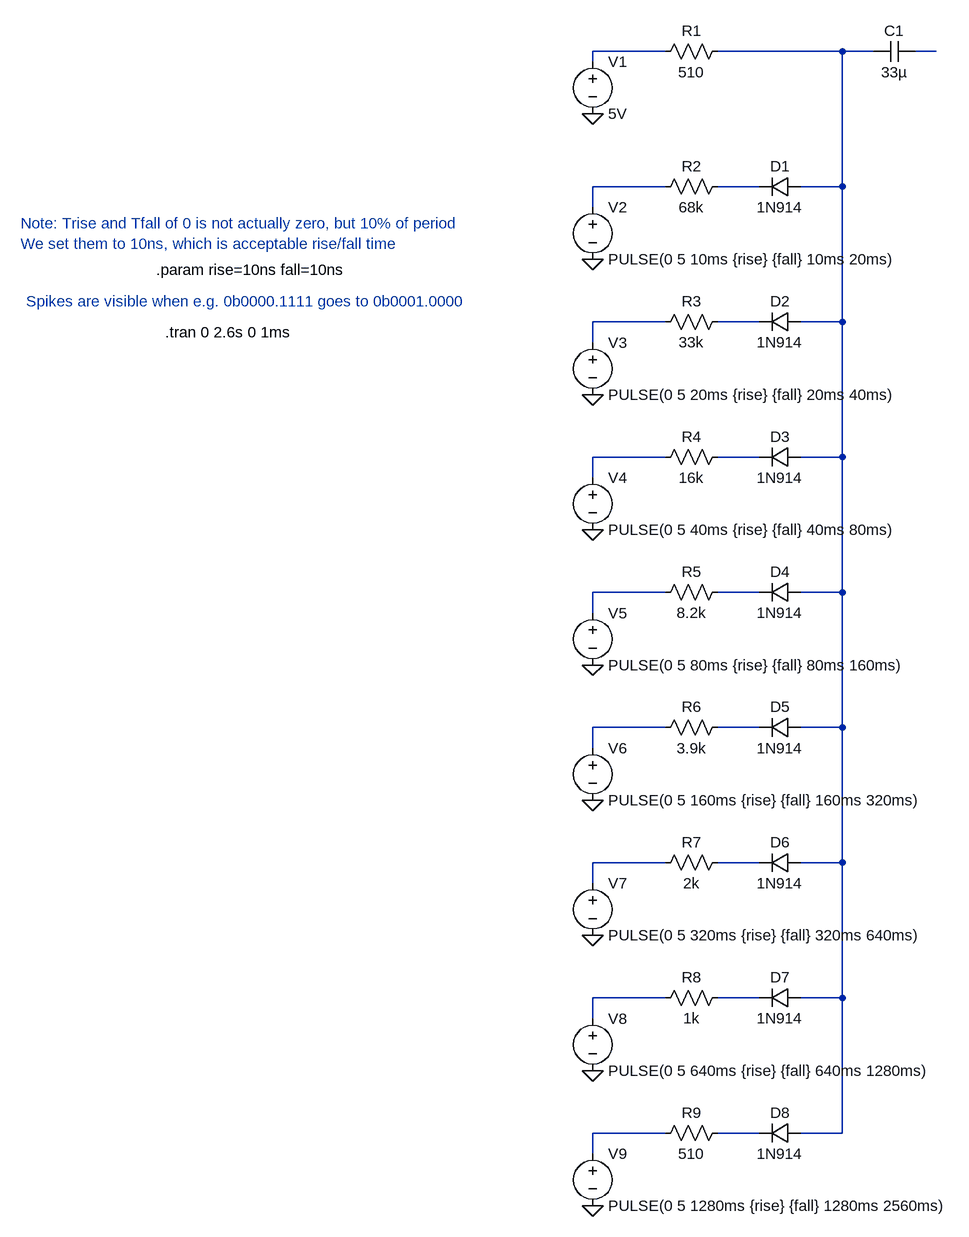
[diagram p0: schematic 542B-DAC.asc]
542B-DAC.asc, the LTspice schematic file:
Version 4
SHEET 1 880 1880
WIRE 144 64 32 64
WIRE 416 64 224 64
WIRE 464 64 416 64
WIRE 560 64 528 64
WIRE 32 80 32 64
WIRE 144 272 32 272
WIRE 288 272 224 272
WIRE 416 272 416 64
WIRE 416 272 352 272
WIRE 32 304 32 272
WIRE 144 480 32 480
WIRE 288 480 224 480
WIRE 416 480 416 272
WIRE 416 480 352 480
WIRE 32 512 32 480
WIRE 144 688 32 688
WIRE 288 688 224 688
WIRE 416 688 416 480
WIRE 416 688 352 688
WIRE 32 720 32 688
WIRE 144 896 32 896
WIRE 288 896 224 896
WIRE 416 896 416 688
WIRE 416 896 352 896
WIRE 32 928 32 896
WIRE 144 1104 32 1104
WIRE 288 1104 224 1104
WIRE 416 1104 416 896
WIRE 416 1104 352 1104
WIRE 32 1136 32 1104
WIRE 144 1312 32 1312
WIRE 288 1312 224 1312
WIRE 416 1312 416 1104
WIRE 416 1312 352 1312
WIRE 32 1344 32 1312
WIRE 144 1520 32 1520
WIRE 288 1520 224 1520
WIRE 416 1520 416 1312
WIRE 416 1520 352 1520
WIRE 32 1552 32 1520
WIRE 144 1728 32 1728
WIRE 288 1728 224 1728
WIRE 416 1728 416 1520
WIRE 416 1728 352 1728
WIRE 32 1760 32 1728
FLAG 32 160 0
FLAG 32 384 0
FLAG 32 592 0
FLAG 32 800 0
FLAG 32 1008 0
FLAG 32 1216 0
FLAG 32 1424 0
FLAG 32 1632 0
FLAG 32 1840 0
SYMBOL voltage 32 64 R0
WINDOW 123 0 0 Left 0
WINDOW 39 0 0 Left 0
SYMATTR InstName V1
SYMATTR Value 5V
SYMBOL res 240 48 R90
WINDOW 0 0 56 VBottom 2
WINDOW 3 32 56 VTop 2
SYMATTR InstName R1
SYMATTR Value 510
SYMBOL res 240 256 R90
WINDOW 0 0 56 VBottom 2
WINDOW 3 32 56 VTop 2
SYMATTR InstName R2
SYMATTR Value 68k
SYMBOL diode 352 256 R90
WINDOW 0 0 32 VBottom 2
WINDOW 3 32 32 VTop 2
SYMATTR InstName D1
SYMATTR Value 1N914
SYMBOL cap 528 48 R90
WINDOW 0 0 32 VBottom 2
WINDOW 3 32 32 VTop 2
SYMATTR InstName C1
SYMATTR Value 33µ
SYMBOL voltage 32 288 R0
WINDOW 123 0 0 Left 0
WINDOW 39 0 0 Left 0
SYMATTR InstName V2
SYMATTR Value PULSE(0 5 10ms {rise} {fall} 10ms 20ms)
SYMBOL res 240 464 R90
WINDOW 0 0 56 VBottom 2
WINDOW 3 32 56 VTop 2
SYMATTR InstName R3
SYMATTR Value 33k
SYMBOL diode 352 464 R90
WINDOW 0 0 32 VBottom 2
WINDOW 3 32 32 VTop 2
SYMATTR InstName D2
SYMATTR Value 1N914
SYMBOL voltage 32 496 R0
WINDOW 123 0 0 Left 0
WINDOW 39 0 0 Left 0
SYMATTR InstName V3
SYMATTR Value PULSE(0 5 20ms {rise} {fall} 20ms 40ms)
SYMBOL res 240 672 R90
WINDOW 0 0 56 VBottom 2
WINDOW 3 32 56 VTop 2
SYMATTR InstName R4
SYMATTR Value 16k
SYMBOL diode 352 672 R90
WINDOW 0 0 32 VBottom 2
WINDOW 3 32 32 VTop 2
SYMATTR InstName D3
SYMATTR Value 1N914
SYMBOL voltage 32 704 R0
WINDOW 123 0 0 Left 0
WINDOW 39 0 0 Left 0
SYMATTR InstName V4
SYMATTR Value PULSE(0 5 40ms {rise} {fall} 40ms 80ms)
SYMBOL res 240 880 R90
WINDOW 0 0 56 VBottom 2
WINDOW 3 32 56 VTop 2
SYMATTR InstName R5
SYMATTR Value 8.2k
SYMBOL diode 352 880 R90
WINDOW 0 0 32 VBottom 2
WINDOW 3 32 32 VTop 2
SYMATTR InstName D4
SYMATTR Value 1N914
SYMBOL voltage 32 912 R0
WINDOW 123 0 0 Left 0
WINDOW 39 0 0 Left 0
SYMATTR InstName V5
SYMATTR Value PULSE(0 5 80ms {rise} {fall} 80ms 160ms)
SYMBOL res 240 1088 R90
WINDOW 0 0 56 VBottom 2
WINDOW 3 32 56 VTop 2
SYMATTR InstName R6
SYMATTR Value 3.9k
SYMBOL diode 352 1088 R90
WINDOW 0 0 32 VBottom 2
WINDOW 3 32 32 VTop 2
SYMATTR InstName D5
SYMATTR Value 1N914
SYMBOL voltage 32 1120 R0
WINDOW 123 0 0 Left 0
WINDOW 39 0 0 Left 0
SYMATTR InstName V6
SYMATTR Value PULSE(0 5 160ms {rise} {fall} 160ms 320ms)
SYMBOL res 240 1296 R90
WINDOW 0 0 56 VBottom 2
WINDOW 3 32 56 VTop 2
SYMATTR InstName R7
SYMATTR Value 2k
SYMBOL diode 352 1296 R90
WINDOW 0 0 32 VBottom 2
WINDOW 3 32 32 VTop 2
SYMATTR InstName D6
SYMATTR Value 1N914
SYMBOL voltage 32 1328 R0
WINDOW 123 0 0 Left 0
WINDOW 39 0 0 Left 0
SYMATTR InstName V7
SYMATTR Value PULSE(0 5 320ms {rise} {fall} 320ms 640ms)
SYMBOL res 240 1504 R90
WINDOW 0 0 56 VBottom 2
WINDOW 3 32 56 VTop 2
SYMATTR InstName R8
SYMATTR Value 1k
SYMBOL diode 352 1504 R90
WINDOW 0 0 32 VBottom 2
WINDOW 3 32 32 VTop 2
SYMATTR InstName D7
SYMATTR Value 1N914
SYMBOL voltage 32 1536 R0
WINDOW 123 0 0 Left 0
WINDOW 39 0 0 Left 0
SYMATTR InstName V8
SYMATTR Value PULSE(0 5 640ms {rise} {fall} 640ms 1280ms)
SYMBOL res 240 1712 R90
WINDOW 0 0 56 VBottom 2
WINDOW 3 32 56 VTop 2
SYMATTR InstName R9
SYMATTR Value 510
SYMBOL diode 352 1712 R90
WINDOW 0 0 32 VBottom 2
WINDOW 3 32 32 VTop 2
SYMATTR InstName D8
SYMATTR Value 1N914
SYMBOL voltage 32 1744 R0
WINDOW 123 0 0 Left 0
WINDOW 39 0 0 Left 0
SYMATTR InstName V9
SYMATTR Value PULSE(0 5 1280ms {rise} {fall} 1280ms 2560ms)
TEXT -626 496 Left 2 !.tran 0 2.6s 0 1ms
TEXT -848 328 Left 2 ;Note: Trise and Tfall of 0 is not actually zero, but 10% of period
TEXT -848 360 Left 2 ;We set them to 10ns, which is acceptable rise/fall time
TEXT -640 400 Left 2 !.param rise=10ns fall=10ns
TEXT -840 448 Left 2 ;Spikes are visible when e.g. 0b0000.1111 goes to 0b0001.0000

The netlist it stands for:
* 542B-DAC.asc
V1 N001 0 5V
R1 N002 N001 510
R2 N005 N004 68k
D1 N002 N005 1N914
C1 N003 N002 33µ
V2 N004 0 PULSE(0 5 10ms {rise} {fall} 10ms 20ms)
R3 N007 N006 33k
D2 N002 N007 1N914
V3 N006 0 PULSE(0 5 20ms {rise} {fall} 20ms 40ms)
R4 N009 N008 16k
D3 N002 N009 1N914
V4 N008 0 PULSE(0 5 40ms {rise} {fall} 40ms 80ms)
R5 N011 N010 8.2k
D4 N002 N011 1N914
V5 N010 0 PULSE(0 5 80ms {rise} {fall} 80ms 160ms)
R6 N013 N012 3.9k
D5 N002 N013 1N914
V6 N012 0 PULSE(0 5 160ms {rise} {fall} 160ms 320ms)
R7 N015 N014 2k
D6 N002 N015 1N914
V7 N014 0 PULSE(0 5 320ms {rise} {fall} 320ms 640ms)
R8 N017 N016 1k
D7 N002 N017 1N914
V8 N016 0 PULSE(0 5 640ms {rise} {fall} 640ms 1280ms)
R9 N019 N018 510
D8 N002 N019 1N914
V9 N018 0 PULSE(0 5 1280ms {rise} {fall} 1280ms 2560ms)
.model D D
.lib standard.dio
.tran 0 2.6s 0 1ms
* Note: Trise and Tfall of 0 is not actually zero, but 10% of period
* We set them to 10ns, which is acceptable rise/fall time
.param rise=10ns fall=10ns
* Spikes are visible when e.g. 0b0000.1111 goes to 0b0001.0000
.backanno
.end